# Altium project xbreakpassive.PrjPcb
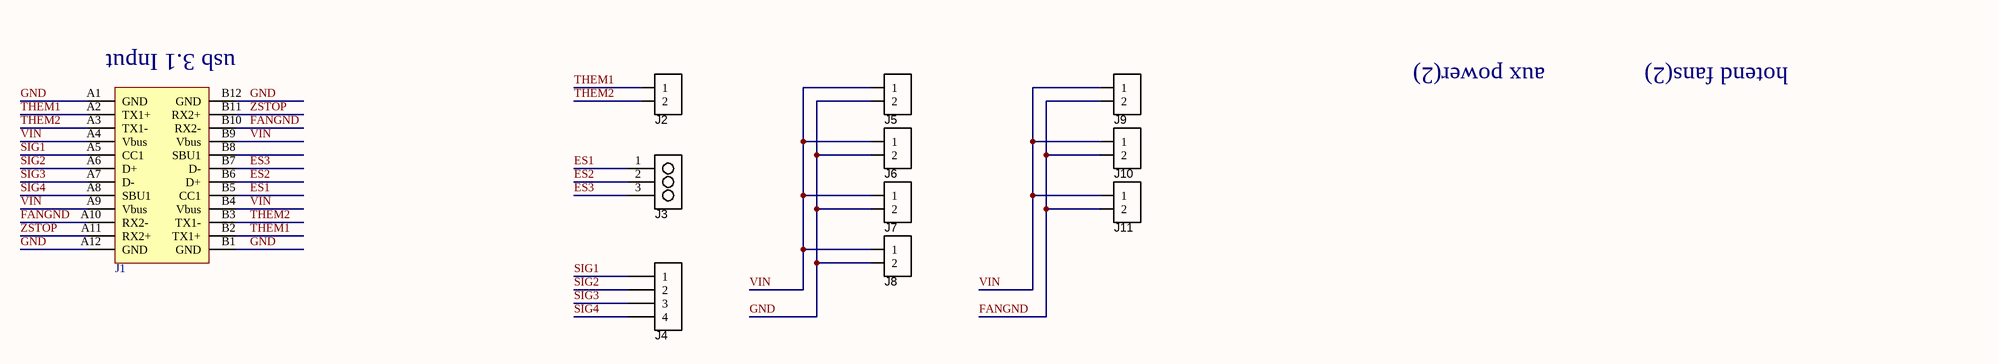
[diagram p0: Sheet1.SchDoc]
1 sheet, 11 parts. Net scope: global (net labels, ports and power ports of the same name join across sheets).
Board file: xbreakpassive.PcbDoc

## Sheet Sheet1.SchDoc
size A3

### Parts
J1  USB_3_1  [USB_3.1]  (value not drawn)
J2  Connector, jumper  [JMP2_RA]  (value not drawn)
J3  CONN_SOCKET_1x3P_0.100in  [1x3POS_SOCKET_LOWPROF]  (value not drawn)
J4  (no value)  [HDR1X4_2.54MMP]
J5  Connector, jumper  [JMP2_RA]  (value not drawn)
J6  Connector, jumper  [JMP2_RA]  (value not drawn)
J7  Connector, jumper  [JMP2_RA]  (value not drawn)
J8  Connector, jumper  [JMP2_RA]  (value not drawn)
J9  Connector, jumper  [JMP2_RA]  (value not drawn)
J10  Connector, jumper  [JMP2_RA]  (value not drawn)
J11  Connector, jumper  [JMP2_RA]  (value not drawn)

### Nets
ES1: J1.B5(CC1) J3.1
ES2: J1.B6(D+) J3.2
ES3: J1.B7(D-) J3.3
FANGND: J1.A10(RX2-) J1.B10(RX2-) J9.2 J10.2 J11.2
GND: J1.A1(GND) J1.A12(GND) J1.B1(GND) J1.B12(GND) J5.2 J6.2 J7.2 J8.2
SIG1: J1.A5(CC1) J4.1
SIG2: J1.A6(D+) J4.2
SIG3: J1.A7(D-) J4.3
SIG4: J1.A8(SBU1) J4.4
THEM1: J1.A2(TX1+) J1.B2(TX1+) J2.1
THEM2: J1.A3(TX1-) J1.B3(TX1-) J2.2
VIN: J1.A4(Vbus) J1.A9(Vbus) J1.B4(Vbus) J1.B9(Vbus) J5.1 J6.1 J7.1 J8.1 J9.1 J10.1 J11.1
ZSTOP: J1.A11(RX2+) J1.B11(RX2+)

Not connected (* = marked no-connect by the designer): J1 B8(SBU1)

### Notes on the sheet
- (near J1) usb 3.1 Input
- aux power(2)
- hotend fans(2)

### Library data of the parts
J1 = USB 3.1: USB 3.1 Connector; Manufacturer: Amphenol Commercial Products; Manufacturer Part Number: 12401548E4#2A; Connector Type: USB - C; Number of Contacts: 24; Gender: Receptacle; Specifications: USB 3.1, Superspeed+; Supplier 1: Digi-Key; Supplier Part Number 1: 12401548E4#2ACT-ND; RoHS: RoHS Compliant; Category: Connectors, Interconnects; Stock 1: 5275; Pricing 1: 1=1.87, 10=1.698, 25=1.594, 50=1.5246, 100=1.4553, 250=1.31672 (USD); Packaging: Cut Tape (CT); Mounting Type: Surface Mount, Right Angle; Through Hole; Features: Board Guide; Ingress Protection: -; ComponentLink1URL: https://www.amphenolcanada.com/ProductSearch/drawings/AC/12401548E4#2A.pdf; ComponentLink1Description: https://www.amphenolcanada.com/ProductSearch/drawings/AC/12401548E4#2A.pdf
J2 J5-J11 = CONN_JMP_RA: Connector Header 0.100in Right-angle single row; Manufacturer 1: Samtec Inc; Manufacturer Part Number 1: TSW-150-08-L-S-RA; QtyOverride: 0.05; SCDType: undef; Package / Case: Single-row pin header, male; Material: Plastic, metal; Supplier 1: Digi-Key; Supplier Part Number 1: SAM1043-50-ND
J3 = CONN_SOCKET_1x3P_0.100in: Socket header THT 3-Pos Low profile Single-row 2.54mm pitch; Manufacturer 1: Mill-Max Manufacturing Corp.; Manufacturer Part Number 1: 801-93-064-10-002000; Pitch: 0.100" (2.54mm); Value: 1x3 Pos.; QtyOverride: 0.05; SCDType: undef; Category: Connectors; Mounting Type: Through Hole; Package / Case: Socket header; 2.54mm pitch; Supplier 1: Digi-Key; Supplier Part Number 1: ED2764-ND
J4 = Header4P: Header 4-pin